# EAGLE design lightswitchx1_triac (EAGLE 7.6.0)
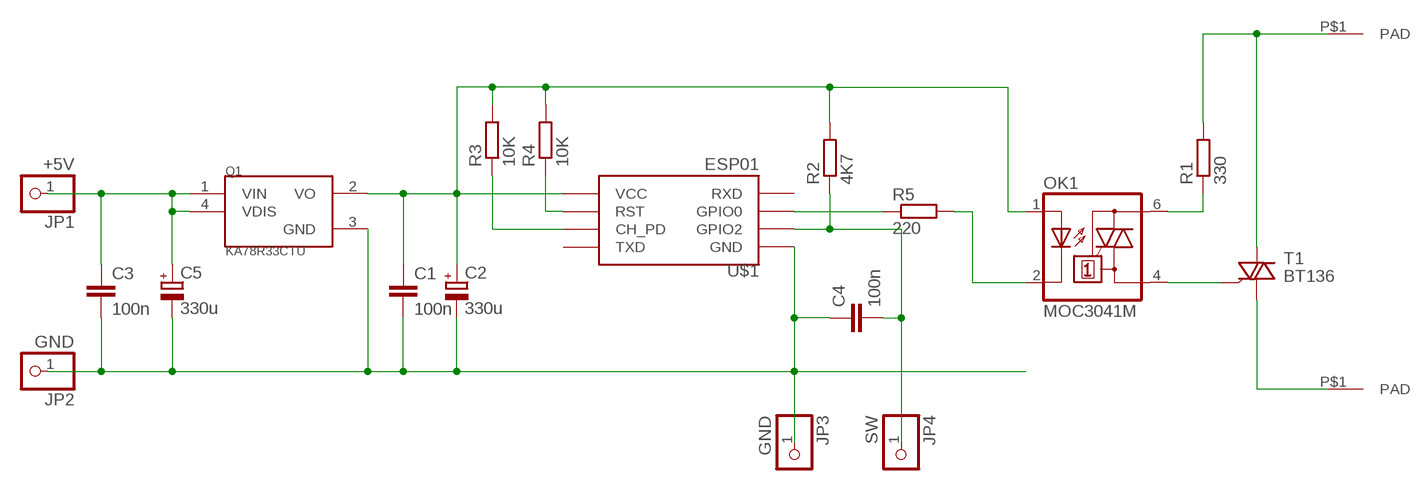
[diagram p0: schematic, sheet 1]

## Parts
C1  100n  C-EU025-030X050  [C025-030X050]
C2  330u  CPOL-EUE2-5  [E2-5]
C3  100n  C-EU025-030X050  [C025-030X050]
C4  100n  C-EU025-030X050  [C025-030X050]
C5  330u  CPOL-EUE2-5  [E2-5]
JP1  +5V  PINHD-1X1  [1X01]
JP2  GND  PINHD-1X1  [1X01]
JP3  GND  PINHD-1X1  [1X01]
JP4  SW  PINHD-1X1  [1X01]
OK1  MOC3041M  [DIL06]
Q1  KA78R33CTU  [TO-220-4]
R1  330  R-EU_0207/7  [0207/7]
R2  4K7  R-EU_0207/10  [0207/10]
R3  10K  R-EU_0207/10  [0207/10]
R4  10K  R-EU_0207/10  [0207/10]
R5  220  R-EU_0207/7  [0207/7]
T1  BT136  [TO220AB]
U$1  ESP01  [ESP01]
U$4  PAD  [PAD]
U$5  PAD  [PAD]

## Nets
N$1: C4.2 JP4.1 R2.1 U$1.GPIO2
N$2: C1.2 C2.- C3.2 C4.1 C5.- JP2.1 JP3.1 Q1.3(GND) U$1.GND
N$3: C1.1 C2.+ OK1.1(A) Q1.2(VO) R2.2 R3.2 R4.2 U$1.VCC
N$4: OK1.4(A1) T1.3(G)
N$5: C3.1 C5.+ JP1.1 Q1.1(VIN) Q1.4(VDIS)
N$6: R5.1 U$1.GPIO0
N$7: OK1.6(A2) R1.1
N$8: R4.1 U$1.RST
N$9: R3.1 U$1.CH_PD
N$10: R1.2 T1.2(A2) U$5.P$1(PAD)
N$11: T1.1(A1) U$4.P$1(PAD)
N$12: OK1.2(C) R5.2
Unconnected: U$1.RX(RXD) U$1.TX(TXD)

## Library data of the parts
C1 C3 C4 = rcl:C-EU: CAPACITOR, European symbol
C2 C5 = rcl:CPOL-EU: POLARIZED CAPACITOR, European symbol
JP1-JP4 = adafruit:PINHD-1X1: Pin header 1x1 for 0.1" spacing With round pins
OK1 = optocoupler:MOC30*: 6-Pin DIP Zero-Cross Optoisolators Triac Driver Output (250/400 Volt Peak) Source: Data sheet <http://www.fairchildsemi.com/ds/MO/MOC3031M.pdf> The old path of data sheet not more available 2013-05-06.; MF: FAIRCHILD SEMICONDUCTOR; MPN: MOC3041M; OC_FARNELL: 1086677; OC_NEWARK: 78K6090
Q1 = KA78R33CTU:KA78R33CTU: KA78R Series 3.3 V Fixed Output 1 A LDO Voltage Regulator - TO-220F-4L; AVAILABILITY: Good; DESCRIPTION: KA78R Series 3.3 V Fixed Output 1 A LDO Voltage Regulator - TO-220F-4L; MF: Fairchild Semiconductor; MP: KA78R33CTU; PACKAGE: TO-220 Fairchild Semiconductor; PRICE: 0.55 USD
R1-R5 = rcl:R-EU_: RESISTOR, European symbol
T1 = triac:BT136: Triac BT136 series E sensitive gate Source: http://www.nxp.com/acrobat_download/datasheets/BT136_SERIES_E_2.pdf
U$1 = esp8266modules:ESP01: ESP8266 Wifi module 01
U$4 U$5 = LEG-1A-5:PAD

## Board
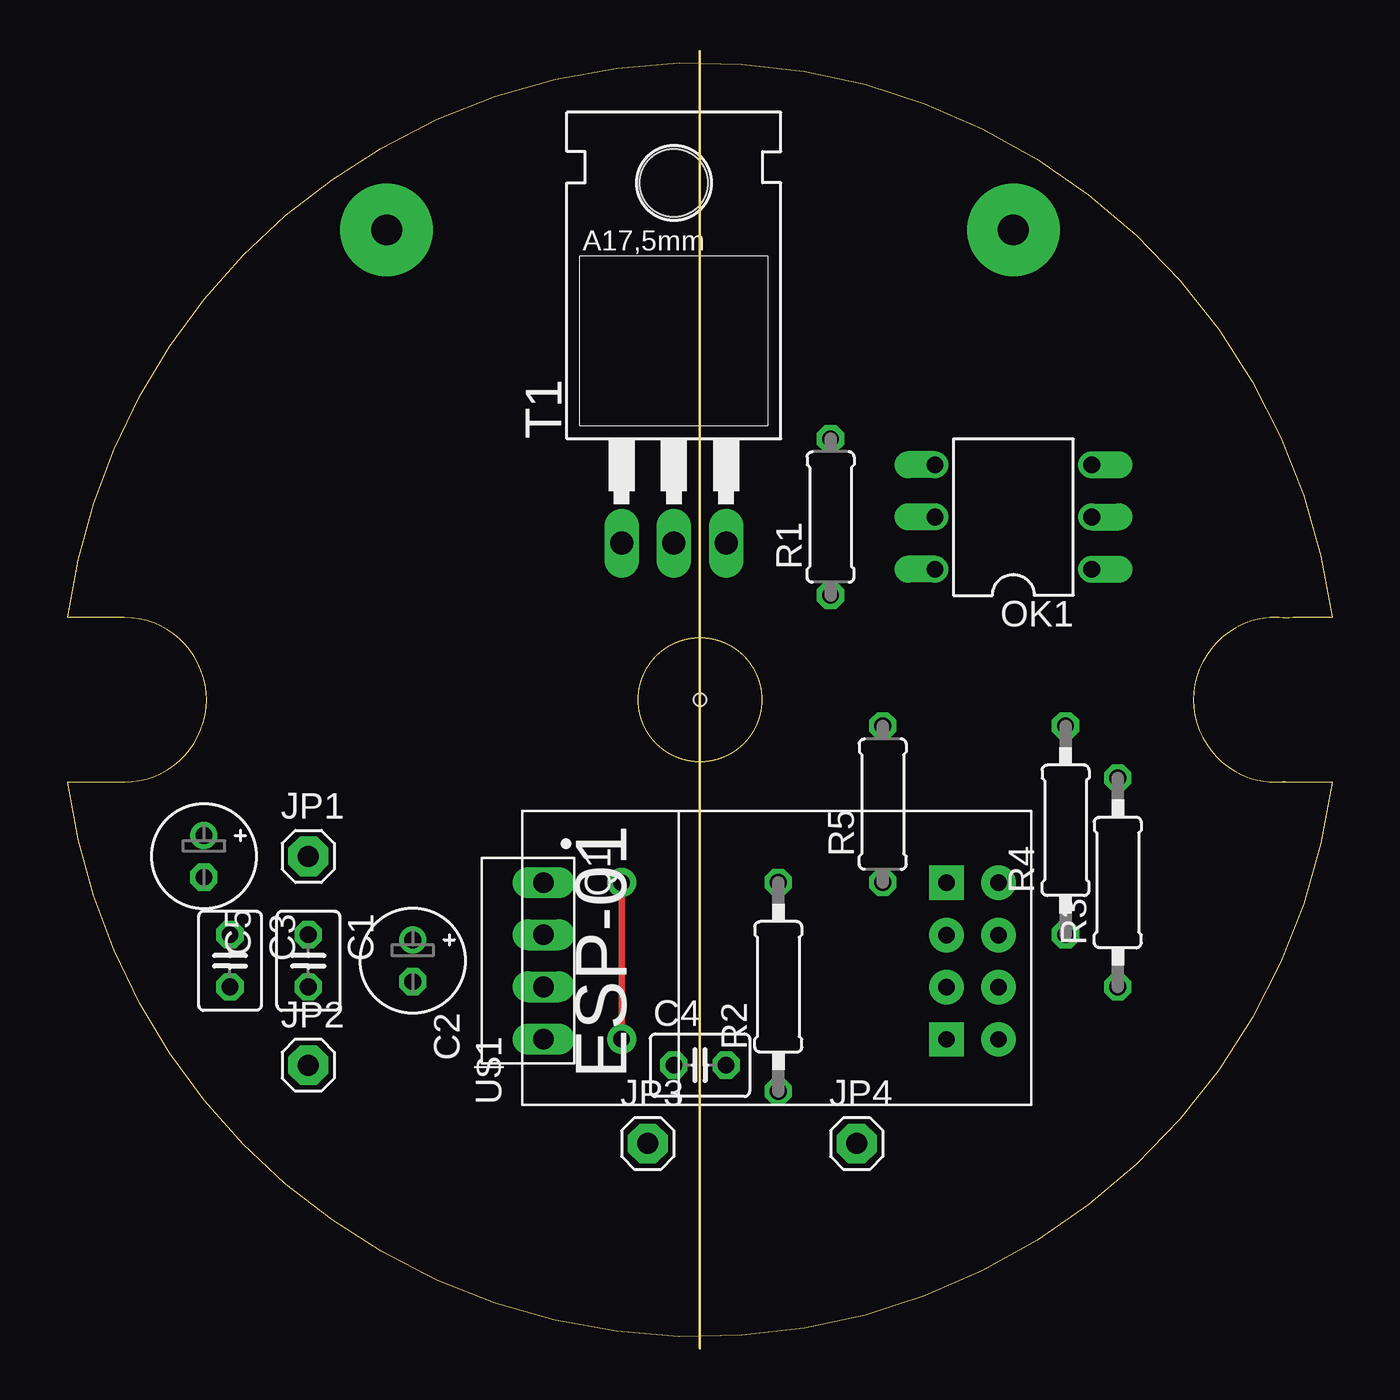
[diagram p1: board, top side]
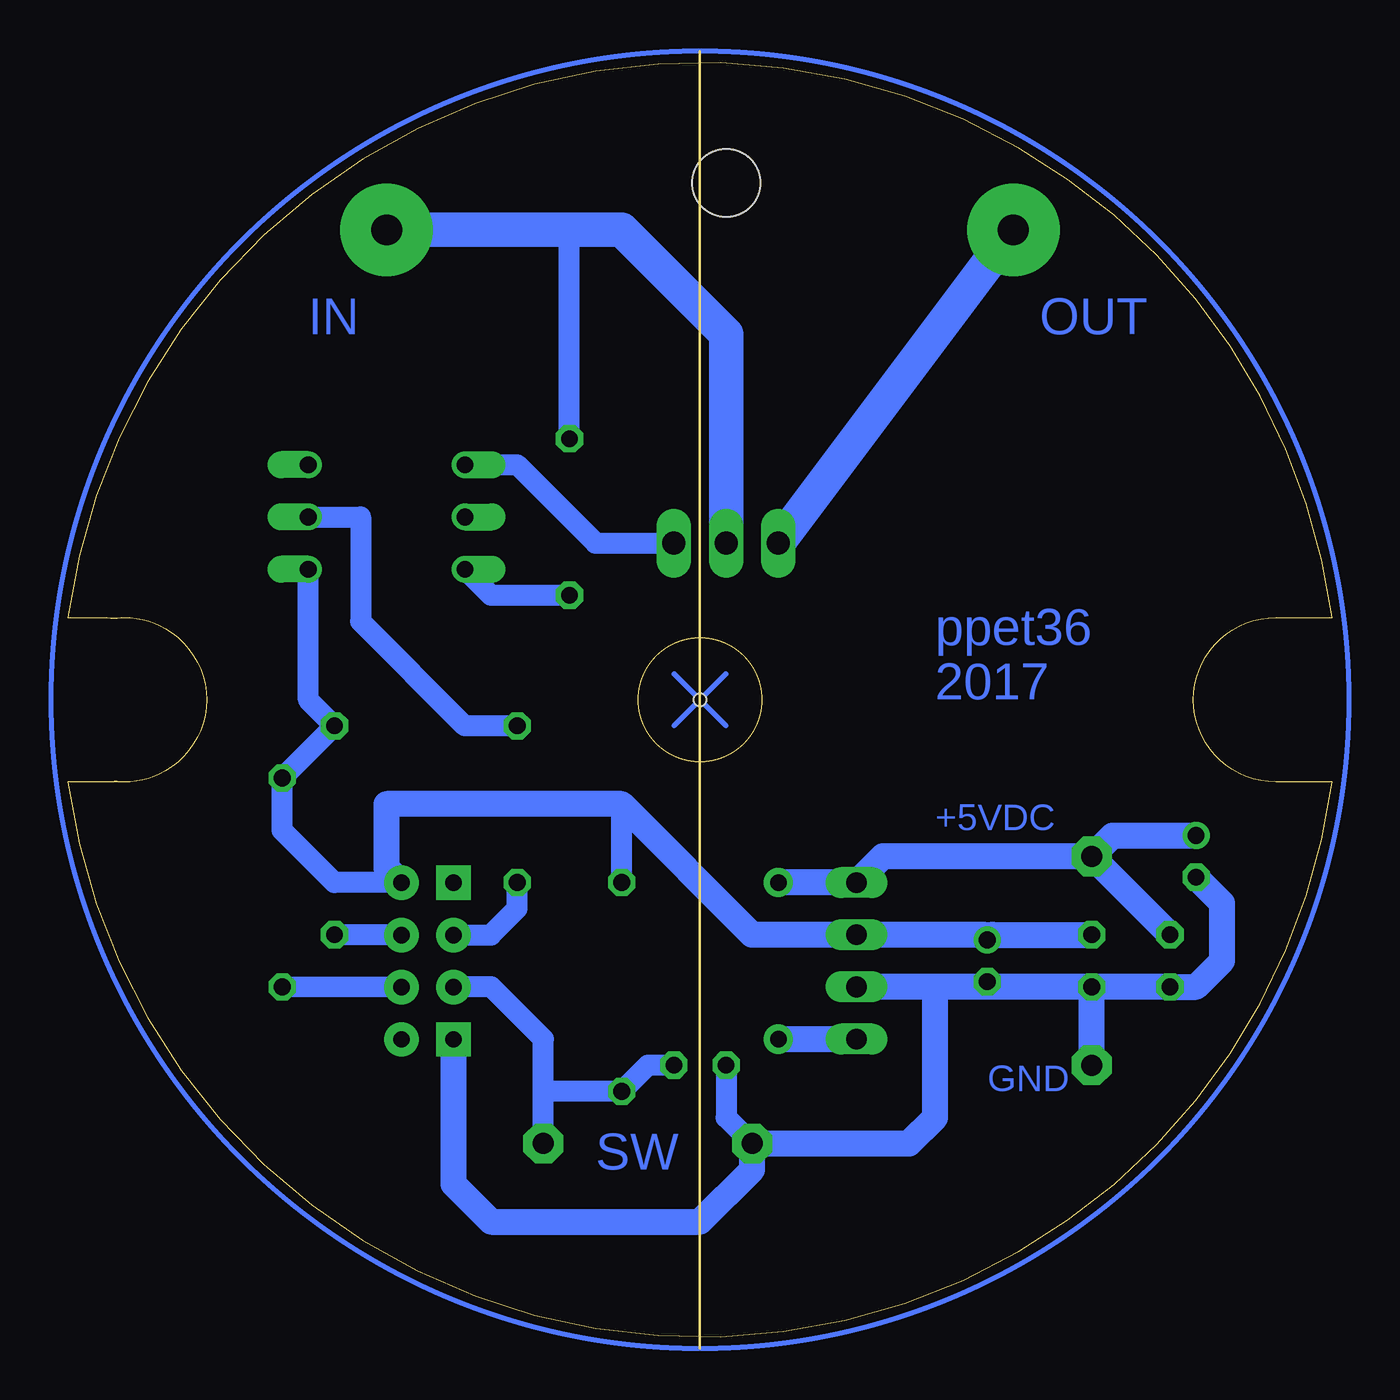
[diagram p2: board, bottom side, seen from below]

Size 61.48 x 61.97 mm. Coordinates in mm from the lower left corner, seen from the top.
Outline: 58.74,26.98 61.48,26.98 arc-113 15.24,4.14 arc-53 0,26.98 2.74,26.98 arc90 6.74,30.98 arc90 2.74,34.98 0,34.98 arc-53 15.24,57.83 arc-113 61.48,34.98 59.74,34.98 arc7 59.24,34.95 arc7 58.74,34.98 arc30 56.74,34.45 arc120 56.74,27.52 arc30 58.74,26.98
Outline: 58.74,26.98 arc7 59.24,27.02
Outline: circle at 30.74,30.98 radius 3
Copper layers (1*16): Top 0.035mm / dielectric 1.5mm / Bottom 0.035mm
Design rules "default": minimum track width 10mil, minimum drill 24mil, track to track 8mil, track to pad 8mil, pad to pad 8mil, via to via 8mil, smd to smd 8mil, copper to edge 40mil, drill to drill 8mil, minimum pad ring 10mil, minimum via ring 8mil, stop-mask expansion 4mil, vias tented up to drill 0mil, thermal gap 10mil
Holes 0.6 mm at 30.74,30.98

### Footprints (pad centres in the part's own frame; a part is rotated, then mirrored left to right if it is on the bottom)
C025-030X050 = drill 0.813 octagon: 1 -1.27,0; 2 1.27,0
E2-5 = drill 0.813 pad 1.27: + -1.016,0 | drill 0.813 pad 1.27 octagon: - 1.016,0
1X01 = drill 1.016 pad 1.93 octagon: 1 0,0
DIL06 = drill 0.813 offset: 1 -2.54,-3.81; 2 0,-3.81; 3 2.54,-3.81; 4 2.54,3.81; 5 0,3.81; 6 -2.54,3.81
TO-220-4 = drill 1 long: 1 -3.81,0; 2 -1.27,0; 3 1.27,0; 4 3.81,0
0207/7 = drill 0.813 octagon: 1 -3.81,0; 2 3.81,0
0207/10 = drill 0.813 octagon: 1 -5.08,0; 2 5.08,0
TO220AB = drill 1.118 long: 1 -2.54,-6.35; 2 0,-6.35; 3 2.54,-6.35 | hole 3.302: 0,11.176
ESP01 = drill 0.8 pad 1.676: CH_PD -1.285,-8.178; GPIO0 1.255,-5.638; GPIO2 -1.285,-5.638; RST 1.255,-8.178; TX -3.825,-8.178; VCC 3.795,-8.178 | drill 0.8 pad 1.676 square: GND -3.825,-5.638; RX 3.795,-5.638
PAD = drill 1.5 pad 4.5: P$1 0,0

### Placement (x,y rotation side)
C1  11.69,18.28 270 top
C2  16.77,18.28 270 top
C3  7.88,18.28 270 top
C4  30.74,13.2 0 top
C5  6.61,23.36 270 top
JP1  11.69,23.36 0 top
JP2  11.69,13.2 0 top
JP3  28.2,9.39 0 top
JP4  38.36,9.39 0 top
OK1  45.98,39.87 90 top
Q1  23.12,18.28 270 top
R1  37.09,39.87 90 top
R2  34.55,17.01 90 top
R3  51.06,22.09 90 top
R4  48.52,24.63 90 top
R5  39.63,25.9 90 top
T1  29.47,44.95 0 top
U$1  37.09,18.28 90 top
U$4  15.5,53.84 0 top
U$5  45.98,53.84 0 top

### Tracks (layer width: path | path; a pad name or v marks a point on that pad's centre or on a via)
N$1
  Bottom 0.813: 42.71,17.01 U$1.GPIO2
  Bottom 1.016: JP4.1 38.36,11.93 | 38.36,11.93 R2.1 33.28,13.2 C4.2 | 38.36,11.93 38.36,14.47 40.9,17.01 42.71,17.01
N$2
  Bottom 0.813: 16.77,17.01 C2.-
  Bottom 1.016: C2.- arc90 17.03,17.01 | C4.1 29.47,10.66 JP3.1
  Bottom 1.27: JP2.1 C1.2 | C1.2 C3.2 6.61,17.01 5.34,18.28 5.34,21.08 C5.- | C1.2 16.77,17.01 | 17.03,17.01 19.31,17.01 | 19.31,17.01 Q1.3 | U$1.GND 42.73,7.41 40.9,5.58 30.74,5.58 28.2,8.12 JP3.1 20.58,9.39 19.31,10.66 19.31,17.01
N$3
  Bottom 1.016: R2.2 34.55,25.9 | OK1.1 49.79,30.98 R4.2 R3.2 51.06,24.63 48.52,22.09 45.28,22.09
  Bottom 1.27: C1.1 16.52,19.55 C2.+ arc-90 17.03,19.55 Q1.2 28.2,19.55 34.55,25.9 45.98,25.9 45.98,22.79 U$1.VCC 45.28,22.09
N$4
  Bottom 1.016: OK1.4 39.63,42.41 35.82,38.6 T1.3
N$5  (via drill 0.8 pad 1.42)
  Top 0.305: v26.93,22.09 v26.93,14.47
  Bottom 1.27: v26.93,22.09 Q1.1 21.85,23.36 JP1.1 | v26.93,14.47 Q1.4 | JP1.1 10.68,24.38 C5.+ | C3.1 JP1.1
N$6
  Bottom 1.016: U$1.GPIO0 40.92,19.54 39.63,20.82 R5.1
N$7
  Bottom 1.016: R1.1 40.9,36.06 OK1.6
N$8
  Bottom 1.016: U$1.RST R4.1
N$9
  Bottom 1.016: U$1.CH_PD R3.1
N$10
  Bottom 1.016: R1.2 37.09,53.84
  Bottom 1.676: T1.2 29.47,48.76 34.55,53.84 37.09,53.84 U$5.P$1
N$11
  Bottom 1.676: T1.1 U$4.P$1
N$12
  Bottom 1.016: OK1.2 47.25,39.87 47.25,34.79 42.17,29.71 R5.2
N$13
  Bottom 0.254: 29.47,29.71 32.01,32.25
N$14
  Bottom 0.254: 29.47,32.25 32.01,29.71
(copper drawn outside any net)
  shapes: Bottom circle x1

### Text on the board
Bottom: OUT | IN | ppet36 / 2017 | +5VDC | GND | SW